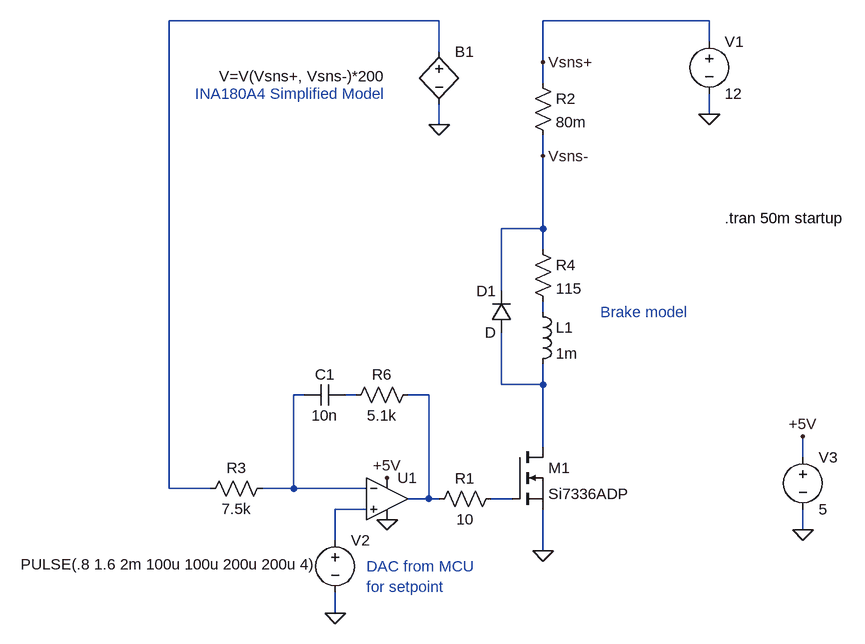
[diagram p0: schematic treadmill_linear_brake_driver.asc]
treadmill_linear_brake_driver.asc, the LTspice schematic file:
Version 4
SHEET 1 1000 680
WIRE 352 -336 -64 -336
WIRE 768 -336 512 -336
WIRE 768 -304 768 -336
WIRE 352 -288 352 -336
WIRE 512 -272 512 -336
WIRE 512 -240 512 -272
WIRE 768 -192 768 -224
WIRE 352 -176 352 -208
WIRE 512 -128 512 -160
WIRE 512 -16 512 -128
WIRE 512 -16 448 -16
WIRE 512 16 512 -16
WIRE 448 80 448 -16
WIRE 512 112 512 96
WIRE 448 224 448 144
WIRE 512 224 512 192
WIRE 512 224 448 224
WIRE 144 240 128 240
WIRE 224 240 208 240
WIRE 336 240 304 240
WIRE 512 320 512 224
WIRE 912 336 912 304
WIRE -64 384 -64 -336
WIRE 0 384 -64 384
WIRE 128 384 128 240
WIRE 128 384 80 384
WIRE 240 384 128 384
WIRE 336 400 336 240
WIRE 336 400 304 400
WIRE 352 400 336 400
WIRE 464 400 432 400
WIRE 240 416 192 416
WIRE 912 448 912 416
WIRE 192 464 192 416
WIRE 512 480 512 416
WIRE 192 576 192 544
FLAG 512 480 0
FLAG 768 -192 0
FLAG 512 -272 Vsns+
FLAG 512 -128 Vsns-
FLAG 352 -176 0
FLAG 192 576 0
FLAG 912 448 0
FLAG 912 304 +5V
FLAG 272 368 +5V
FLAG 272 432 0
SYMBOL Opamps\\UniversalOpamp2 272 400 R0
SYMATTR InstName U1
SYMATTR Value2 Avol=1.5Meg GBW=24Meg Slew=12Meg
SYMBOL nmos 464 320 R0
SYMATTR InstName M1
SYMATTR Value Si7336ADP
SYMBOL res 448 384 R90
WINDOW 0 0 56 VBottom 2
WINDOW 3 32 56 VTop 2
SYMATTR InstName R1
SYMATTR Value 10
SYMBOL voltage 768 -320 R0
WINDOW 123 0 0 Left 0
WINDOW 39 0 0 Left 0
SYMATTR InstName V1
SYMATTR Value 12
SYMBOL ind 496 96 R0
SYMATTR InstName L1
SYMATTR Value 1m
SYMBOL diode 464 144 R180
WINDOW 0 24 64 Left 2
WINDOW 3 24 0 Left 2
SYMATTR InstName D1
SYMBOL res 496 -256 R0
SYMATTR InstName R2
SYMATTR Value 80m
SYMBOL bv 352 -304 R0
WINDOW 3 -339 53 Left 2
SYMATTR Value V=V(Vsns+, Vsns-)*200
SYMATTR InstName B1
SYMBOL voltage 192 448 R0
WINDOW 3 -484 53 Left 2
WINDOW 123 0 0 Left 0
WINDOW 39 0 0 Left 0
SYMATTR Value PULSE(.8 1.6 2m 100u 100u 200u 200u 4)
SYMATTR InstName V2
SYMBOL voltage 912 320 R0
WINDOW 123 0 0 Left 0
WINDOW 39 0 0 Left 0
SYMATTR InstName V3
SYMATTR Value 5
SYMBOL cap 208 224 R90
WINDOW 0 0 32 VBottom 2
WINDOW 3 32 32 VTop 2
SYMATTR InstName C1
SYMATTR Value 10n
SYMBOL res 96 368 R90
WINDOW 0 0 56 VBottom 2
WINDOW 3 32 56 VTop 2
SYMATTR InstName R3
SYMATTR Value 7.5k
SYMBOL res 496 0 R0
SYMATTR InstName R4
SYMATTR Value 115
SYMBOL res 320 224 R90
WINDOW 0 0 56 VBottom 2
WINDOW 3 32 56 VTop 2
SYMATTR InstName R6
SYMATTR Value 5.1k
TEXT -24 -224 Left 2 ;INA180A4 Simplified Model
TEXT 792 -32 Left 2 !.tran 50m startup
TEXT 600 112 Left 2 ;Brake model
TEXT 240 504 Left 2 ;DAC from MCU\nfor setpoint

The netlist it stands for:
* treadmill_linear_brake_driver.asc
XU1 N008 N004 +5V 0 N006 level.2 Avol=1.5Meg GBW=24Meg Slew=12Meg ilimit=25m rail=0 Vos=0 phimargin=45 en=0 enk=0 in=0 ink=0 Rin=500Meg  ; pins IN+ IN- V+ V- OUT
M1 N003 N007 0 0 Si7336ADP
R1 N007 N006 10
V1 Vsns+ 0 12
L1 N002 N003 1m
D1 N003 Vsns- D
R2 Vsns+ Vsns- 80m
B1 N001 0 V=V(Vsns+, Vsns-)*200
V2 N008 0 PULSE(.8 1.6 2m 100u 100u 200u 200u 4)
V3 +5V 0 5
C1 N005 N004 10n
R3 N004 N001 7.5k
R4 Vsns- N002 115
R6 N006 N005 5.1k
.model D D
.lib standard.dio
.model NMOS NMOS
.model PMOS PMOS
.lib standard.mos
* INA180A4 Simplified Model
.tran 50m startup
* Brake model
* DAC from MCU
* for setpoint
.lib UniversalOpamps2.sub
.backanno
.end